# EAGLE schematic um3567 (EAGLE 6.4)
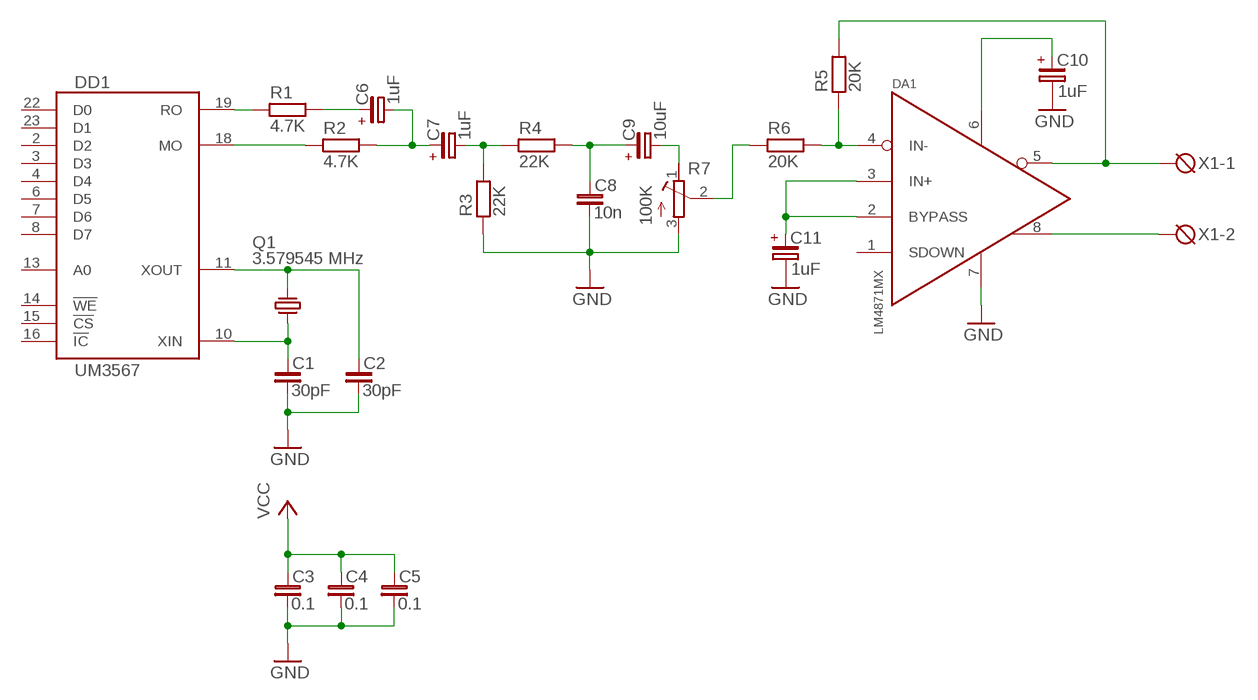
[diagram p0: schematic, sheet 1]

## Parts
C1  30pF  C_0805  [C0805]
C2  30pF  C_0805  [C0805]
C3  0.1  C_0805  [C0805]
C4  0.1  C_0805  [C0805]
C5  0.1  C_0805  [C0805]
C6  1uF  CP_SMCA  [SMC_A]
C7  1uF  CP_SMCA  [SMC_A]
C8  10n  C_0805  [C0805]
C9  10uF  CP_SMCA  [SMC_A]
C10  1uF  CP_SMCA  [SMC_A]
C11  1uF  CP_SMCA  [SMC_A]
DA1  LM4871MX  [SO08]
DD1  UM3567  [DIL24]
Q1  3.579545 MHz  CRYSTAL-HC49S  [HC49/S]
R1  4.7K  R_0805  [R0805]
R2  4.7K  R_0805  [R0805]
R3  22K  R_0805  [R0805]
R4  22K  R_0805  [R0805]
R5  20K  R_0805  [R0805]
R6  20K  R_0805  [R0805]
R7  100K  RTRIM  [RTRIM-3362P]
X1  DG3XX-02-3.5  [DG350-3.5-02P]

## Nets
GND: C1.2 C2.2 C3.2 C4.2 C5.2 C8.2 C10.- C11.- DA1.7(GND) R3.1 R7.3(E)
N$1: C1.1 DD1.10(XIN) Q1.1
N$2: C2.1 DD1.11(XOUT) Q1.2
N$3: DD1.19(RO) R1.1
N$4: DD1.18(MO) R2.1
N$5: C6.- C7.+ R2.2
N$6: C6.+ R1.2
N$7: C7.- R3.2 R4.1
N$8: C8.1 C9.+ R4.2
N$9: C10.+ DA1.6(VCC)
N$10: DA1.4(IN-) R5.1 R6.2
N$11: DA1.5(OUT-) R5.2 X1.1
N$12: C9.- R7.1(A)
N$13: R6.1 R7.2(S)
N$14: C11.+ DA1.2(BYPASS) DA1.3(IN+)
N$15: DA1.8(OUT+) X1.2
VCC: C3.1 C4.1 C5.1
Unconnected: DA1.1(SDOWN) DD1.2(D2) DD1.3(D3) DD1.4(D4) DD1.6(D5) DD1.7(D6) DD1.8(D7) DD1.13(A0) DD1.14(!WE) DD1.15(!CS) DD1.16(!IC) DD1.22(D0) DD1.23(D1)

## Power pins joined to a net without a drawn wire
GND: DD1.1(GND)
VCC: DD1.21(VCC)

## Library data of the parts
C1-C5 C8 = rc-master-smd:C_: NON-POLARIZED CAP
C6 C7 C9-C11 = rc-master-smd:CP_: POLARIZED CAP
DA1 = power_amp:LM4871: 3W Audio Power Amplifier with Shutdown Mode
DD1 = oldschool:UM3567: YM2413 analog. Different pinout!!!
Q1 = crystal:CRYSTAL-: CRYSTAL
R1-R6 = rc-master-smd:R_: RESISTOR
R7 = lcd-char:RTRIM
X1 = degson:DG3XX-02: DG350-3.5-02P DG306-5.0-02P